# Altium schematic sheet BAT_V.SchDoc
size A4
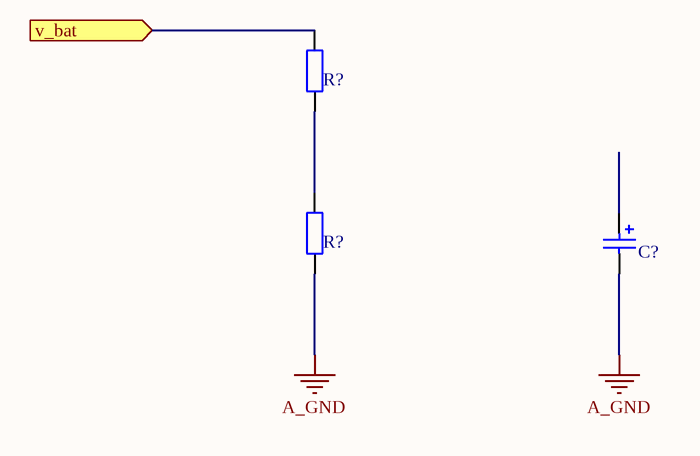
[diagram p0: BAT_V.SchDoc]

## Parts
(Parts that share a designator on the sheet are numbered #1, #2 ... from top to bottom, then left to right.)
C?  10uF  [ECE-CAPAE4X5.4SM]  (value not drawn)
R?#1  47K  [ECE-RESA0.4TH]  (value not drawn)
R?#2  56K  [ECE-RESA0.4TH]  (value not drawn)

## Ports
v_bat (in)

## Nets
A_GND: C?.2 R?#2.1
v_bat: R?#1.2 ; port v_bat
NetR?#1_1: R?#1.1 R?#2.2

Not connected (* = marked no-connect by the designer): C? 1

## Library data of the parts
C? = CAP000303: CAP 10uF 16V ELE SM; Manufactuer: Nichicon; Manufacturer-PN: UWT1C100MCL1GB; Assembly Method: Surface Mount; Item Type: Item; Path: ece/ts/Lists/Stock Inventory; Revision: July-2002: Re-released for DXP Platform.; Value: 10uF; UoA Stock#: CAP000303; Size/Package: 4 X 5.4; Voltage/Current: 16V; Datasheet Link: http://share.engineering.auckland.ac.nz/ece/ts/Student%20Documents/SMT-Ecaps-e-wx.pdf; Supplier1: Digikey; Supplier1-PN: 493-2173-2-ND; Component Type: CAP-4X5.4-10uF-16V; Category: Capacitor; Status: Active
R?#1 = RES000057: RES MF 47K TH; Assembly Method: Through hole; Voltage/Current: 0.6W; Item Type: Item; Path: ece/ts/Lists/Stock Inventory; Value: 47K; UoA Stock#: RES000057; Size/Package: Axial 10mm; Supplier1: Active components; Supplier1-PN: T184047; Component Type: NA; Category: Resistor; Status: Active
R?#2 = RES000058: RES MF 56K TH; Assembly Method: Through hole; Voltage/Current: 0.6W; Item Type: Item; Path: ece/ts/Lists/Stock Inventory; Value: 56K; UoA Stock#: RES000058; Size/Package: Axial 10mm; Supplier1: Active components; Supplier1-PN: T442124; Component Type: NA; Category: Resistor; Status: Active